# Altium schematic sheet interlinkP1A.SchDoc: Board-to-Board P1A
size Legal; CheckedBy: J. Brinton; CompanyName: Signal Laboratories, Inc.; DrawnBy: J. Brinton; Engineer: J. Brinton; Address1: 3479 Edison Way; Address2: Menlo Park CA 94025; Address3: +1 (877) 778-8435; Address4: siglabs.com; DocumentNumber: 42; Revision: 2b; SheetNumber: 43; SheetTotal: 58
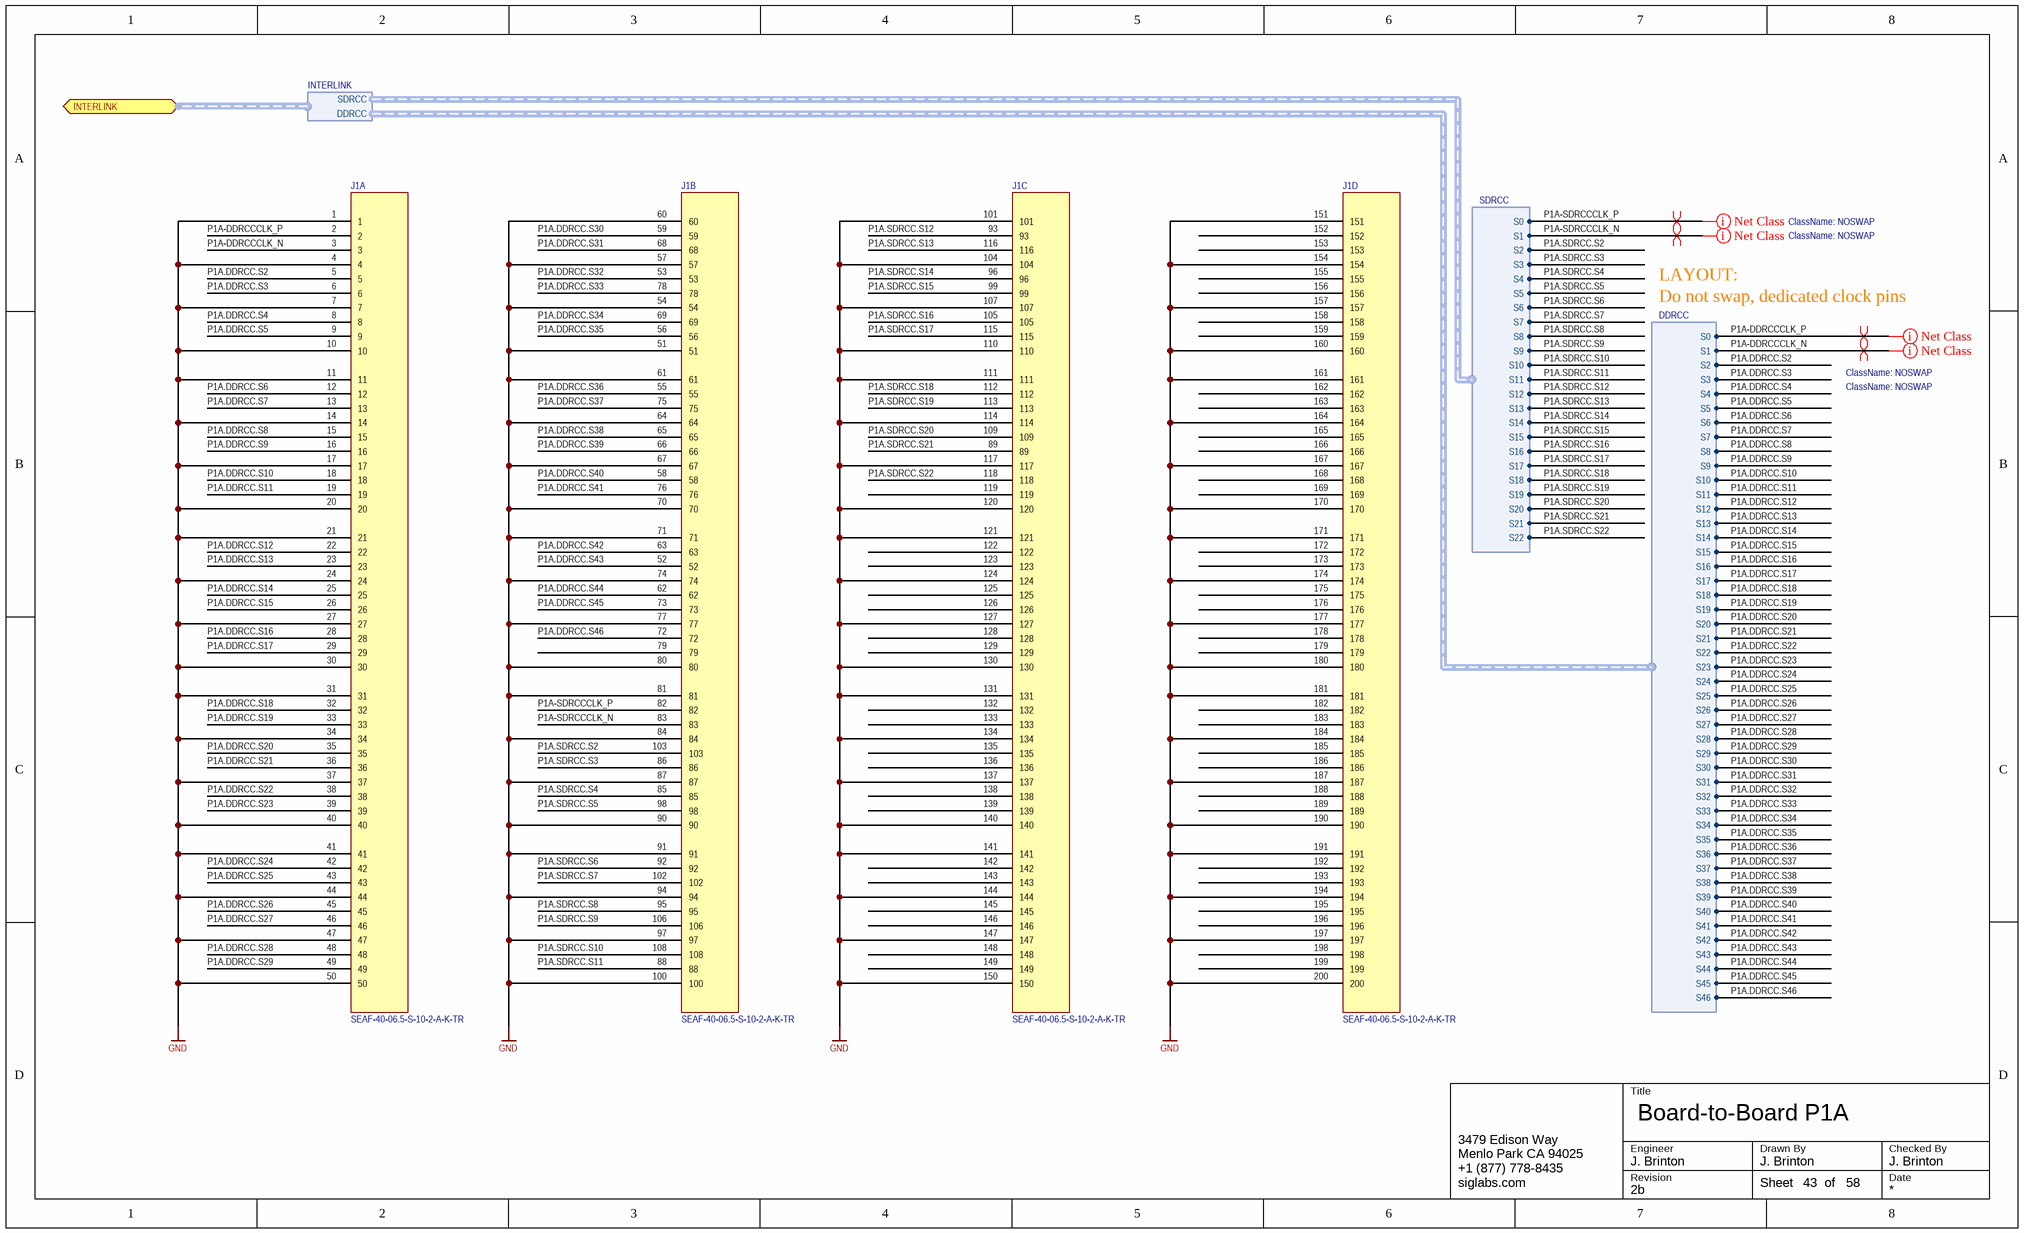
[diagram p0: interlinkP1A.SchDoc]

## Parts
J1  SEAF-40-06.5-S-10-2-A-K-TR  [SEAF-40-06.5-S-10-2-A-K-TR]  (parts A,B,C,D of 8)

## Ports
INTERLINK (harness INTERLINK)

## Harnesses
INTERLINK: DDRCC, SDRCC
DDRCC: S0, S1, S2, S3, S4, S5, S6, S7, S8, S9, S10, S11, S12, S13, S14, S15, S16, S17, S18, S19, S20, S21, S22, S23, S24, S25, S26, S27, S28, S29, S30, S31, S32, S33, S34, S35, S36, S37, S38, S39, S40, S41, S42, S43, S44, S45, S46
SDRCC: S0, S1, S2, S3, S4, S5, S6, S7, S8, S9, S10, S11, S12, S13, S14, S15, S16, S17, S18, S19, S20, S21, S22

## Nets
GND: J1.1 J1.4 J1.7 J1.10 J1.11 J1.14 J1.17 J1.20 J1.21 J1.24 J1.27 J1.30 J1.31 J1.34 J1.37 J1.40 J1.41 J1.44 J1.47 J1.50 J1.51 J1.54 J1.57 J1.60 J1.61 J1.64 J1.67 J1.70 J1.71 J1.74 J1.77 J1.80 J1.81 J1.84 J1.87 J1.90 J1.91 J1.94 J1.97 J1.100 J1.101 J1.104 J1.107 J1.110 J1.111 J1.114 J1.117 J1.120 J1.121 J1.124 J1.127 J1.130 J1.131 J1.134 J1.137 J1.140 J1.141 J1.144 J1.147 J1.150 J1.151 J1.154 J1.157 J1.160 J1.161 J1.164 J1.167 J1.170 J1.171 J1.174 J1.177 J1.180 J1.181 J1.184 J1.187 J1.190 J1.191 J1.194 J1.197 J1.200
P1A-DDRCCCLK_N: J1.3 ; harness DDRCC.S1
P1A-DDRCCCLK_P: J1.2 ; harness DDRCC.S0
P1A-SDRCCCLK_N: J1.83 ; harness SDRCC.S1
P1A-SDRCCCLK_P: J1.82 ; harness SDRCC.S0
P1A.DDRCC.S2: J1.5 ; harness DDRCC.S2
P1A.DDRCC.S3: J1.6 ; harness DDRCC.S3
P1A.DDRCC.S4: J1.8 ; harness DDRCC.S4
P1A.DDRCC.S5: J1.9 ; harness DDRCC.S5
P1A.DDRCC.S6: J1.12 ; harness DDRCC.S6
P1A.DDRCC.S7: J1.13 ; harness DDRCC.S7
P1A.DDRCC.S8: J1.15 ; harness DDRCC.S8
P1A.DDRCC.S9: J1.16 ; harness DDRCC.S9
P1A.DDRCC.S10: J1.18 ; harness DDRCC.S10
P1A.DDRCC.S11: J1.19 ; harness DDRCC.S11
P1A.DDRCC.S12: J1.22 ; harness DDRCC.S12
P1A.DDRCC.S13: J1.23 ; harness DDRCC.S13
P1A.DDRCC.S14: J1.25 ; harness DDRCC.S14
P1A.DDRCC.S15: J1.26 ; harness DDRCC.S15
P1A.DDRCC.S16: J1.28 ; harness DDRCC.S16
P1A.DDRCC.S17: J1.29 ; harness DDRCC.S17
P1A.DDRCC.S18: J1.32 ; harness DDRCC.S18
P1A.DDRCC.S19: J1.33 ; harness DDRCC.S19
P1A.DDRCC.S20: J1.35 ; harness DDRCC.S20
P1A.DDRCC.S21: J1.36 ; harness DDRCC.S21
P1A.DDRCC.S22: J1.38 ; harness DDRCC.S22
P1A.DDRCC.S23: J1.39 ; harness DDRCC.S23
P1A.DDRCC.S24: J1.42 ; harness DDRCC.S24
P1A.DDRCC.S25: J1.43 ; harness DDRCC.S25
P1A.DDRCC.S26: J1.45 ; harness DDRCC.S26
P1A.DDRCC.S27: J1.46 ; harness DDRCC.S27
P1A.DDRCC.S28: J1.48 ; harness DDRCC.S28
P1A.DDRCC.S29: J1.49 ; harness DDRCC.S29
P1A.DDRCC.S30: J1.59 ; harness DDRCC.S30
P1A.DDRCC.S31: J1.68 ; harness DDRCC.S31
P1A.DDRCC.S32: J1.53 ; harness DDRCC.S32
P1A.DDRCC.S33: J1.78 ; harness DDRCC.S33
P1A.DDRCC.S34: J1.69 ; harness DDRCC.S34
P1A.DDRCC.S35: J1.56 ; harness DDRCC.S35
P1A.DDRCC.S36: J1.55 ; harness DDRCC.S36
P1A.DDRCC.S37: J1.75 ; harness DDRCC.S37
P1A.DDRCC.S38: J1.65 ; harness DDRCC.S38
P1A.DDRCC.S39: J1.66 ; harness DDRCC.S39
P1A.DDRCC.S40: J1.58 ; harness DDRCC.S40
P1A.DDRCC.S41: J1.76 ; harness DDRCC.S41
P1A.DDRCC.S42: J1.63 ; harness DDRCC.S42
P1A.DDRCC.S43: J1.52 ; harness DDRCC.S43
P1A.DDRCC.S44: J1.62 ; harness DDRCC.S44
P1A.DDRCC.S45: J1.73 ; harness DDRCC.S45
P1A.DDRCC.S46: J1.72 ; harness DDRCC.S46
P1A.SDRCC.S2: J1.103 ; harness SDRCC.S2
P1A.SDRCC.S3: J1.86 ; harness SDRCC.S3
P1A.SDRCC.S4: J1.85 ; harness SDRCC.S4
P1A.SDRCC.S5: J1.98 ; harness SDRCC.S5
P1A.SDRCC.S6: J1.92 ; harness SDRCC.S6
P1A.SDRCC.S7: J1.102 ; harness SDRCC.S7
P1A.SDRCC.S8: J1.95 ; harness SDRCC.S8
P1A.SDRCC.S9: J1.106 ; harness SDRCC.S9
P1A.SDRCC.S10: J1.108 ; harness SDRCC.S10
P1A.SDRCC.S11: J1.88 ; harness SDRCC.S11
P1A.SDRCC.S12: J1.93 ; harness SDRCC.S12
P1A.SDRCC.S13: J1.116 ; harness SDRCC.S13
P1A.SDRCC.S14: J1.96 ; harness SDRCC.S14
P1A.SDRCC.S15: J1.99 ; harness SDRCC.S15
P1A.SDRCC.S16: J1.105 ; harness SDRCC.S16
P1A.SDRCC.S17: J1.115 ; harness SDRCC.S17
P1A.SDRCC.S18: J1.112 ; harness SDRCC.S18
P1A.SDRCC.S19: J1.113 ; harness SDRCC.S19
P1A.SDRCC.S20: J1.109 ; harness SDRCC.S20
P1A.SDRCC.S21: J1.89 ; harness SDRCC.S21
P1A.SDRCC.S22: J1.118 ; harness SDRCC.S22

Not connected (* = marked no-connect by the designer): J1 79 119 122 123 125 126 128 129 132 133 135 136 138 139 142 143 145 146 148 149 152 153 155 156 158 159 162 163 165 166 168 169 172 173 175 176 178 179 182 183 185 186 188 189 192 193 195 196 198 199

## Layout directives
net class NOSWAP: P1A-DDRCCCLK_N, P1A-DDRCCCLK_P, P1A-SDRCCCLK_N, P1A-SDRCCCLK_P
differential pair: P1A-DDRCCCLK_N, P1A-DDRCCCLK_P, P1A-SDRCCCLK_N, P1A-SDRCCCLK_P

## Notes on the sheet
- Do not swap, dedicated clock pins
- LAYOUT:
- Title
- Engineer
- Revision
- Drawn By
- Checked By
- Date
- Sheet
- of

## Library data of the parts
J1 = SEAF-40-06.5-S-10-2-A-K-TR: Terminal Array Assembly, Surface Mount, 0.050" Pitch, 400 Pins; Manufacturer: Samtec; Manufacturer P/N: SEAF-40-06.5-S-10-2-A-K-TR